# EasyEDA schematic SCH_0516_binaryalarm_2023-05-16.json
TITLE: Sheet_1; REV: 1.0; Date: 2023-05-16; Sheet: 1/1; Drawn By: yubinininin; Company: Your Company
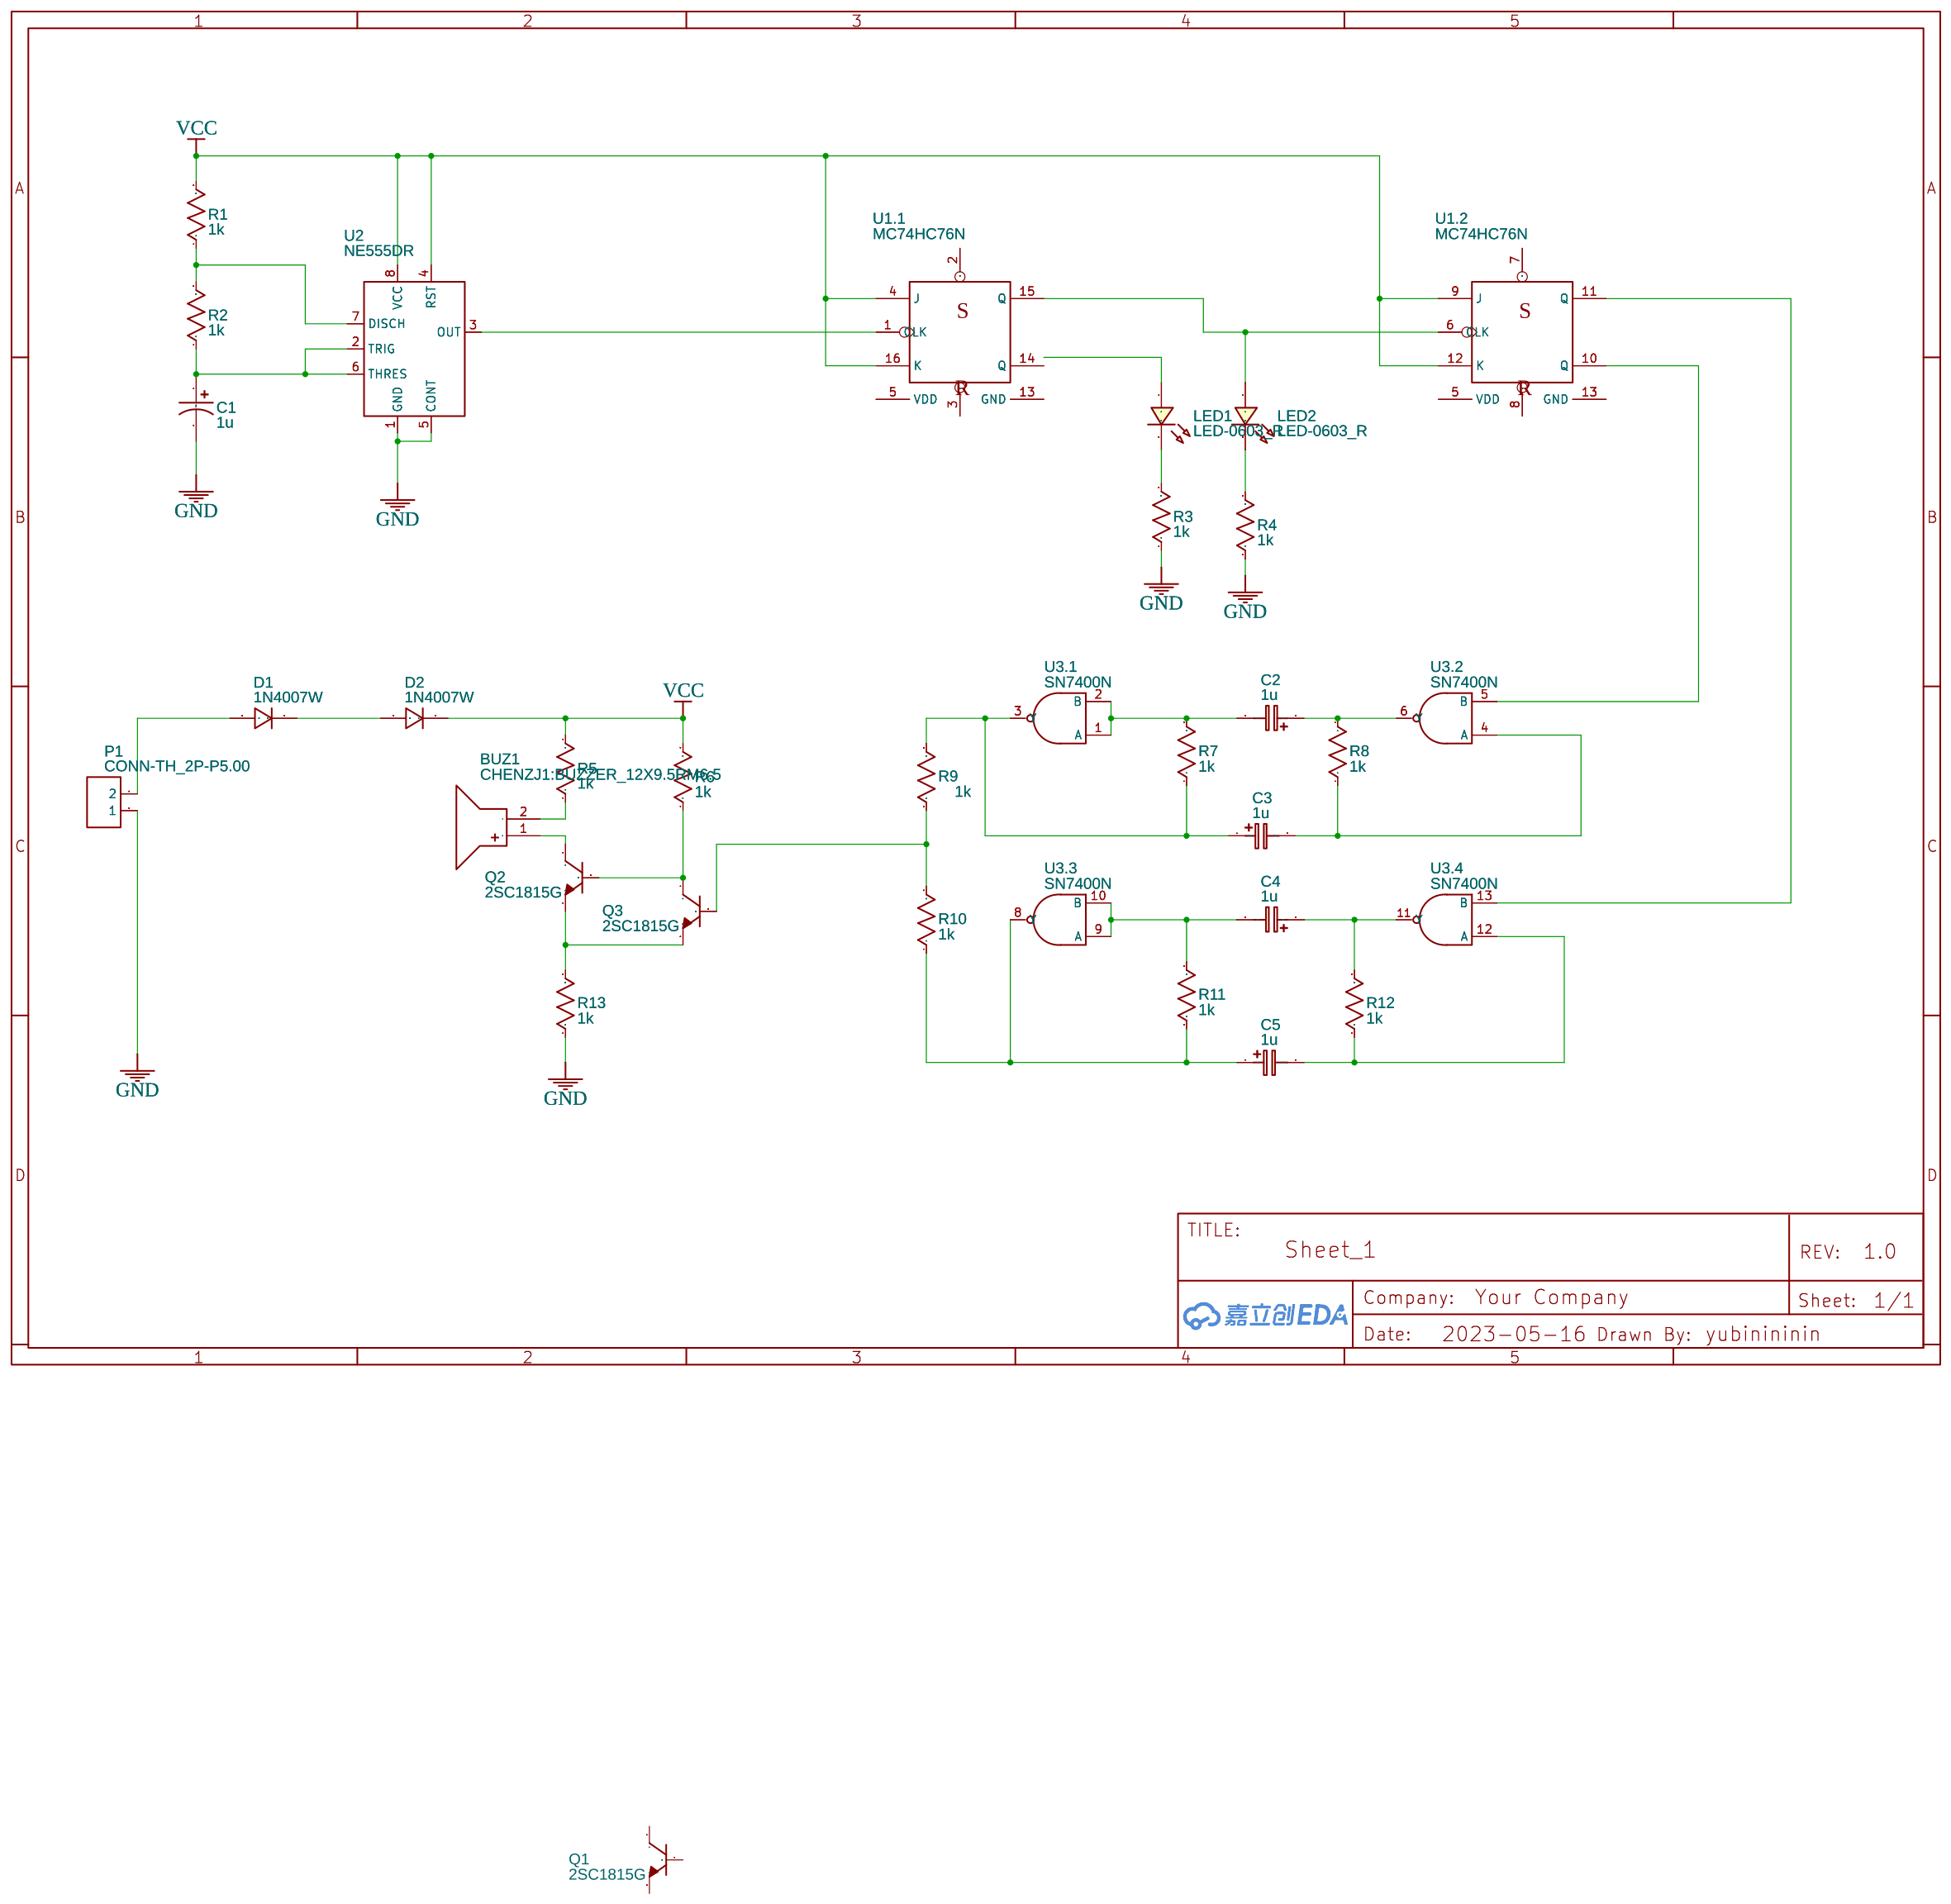
[diagram p0: schematic sheet]

## Parts
BUZ1  CHENZJ1:BUZZER_12X9.5RM6.5  [BUZZ-TH_BD9.8-P5.00-D1.00]
C1  1u  [CAP-D6.3-F2.5]
C2  1u  [CAP-D6.3-F2.5]
C3  1u  [CASE-A_3216]
C4  1u  [CASE-A_3216]
C5  1u  [CASE-A_3216]
D1  1N4007W  [DO-35_BD2.0-L4.2-P8.20-D0.5-RD]
D2  1N4007W  [DO-35_BD2.0-L4.2-P8.20-D0.5-RD]
LED1  LED-0603_R  [LED-TH_BD5.9-P2.54-FD]
LED2  LED-0603_R  [LED-TH_BD5.9-P2.54-FD]
P1  CONN-TH_2P-P5.00  [CONN-TH_2P-P5.00_DB128H-5.0-2P]
Q1  2SC1815G  [TO-92-3_L5.1-W4.1-P1.27-L]
Q2  2SC1815G  [TO-92-3_L5.1-W4.1-P1.27-L]
Q3  2SC1815G  [TO-92-3_L5.1-W4.1-P1.27-L]
R1  1k  [R_AXIAL-0.3]
R2  1k  [R_AXIAL-0.3]
R3  1k  [R_AXIAL-0.3]
R4  1k  [R_AXIAL-0.3]
R5  1k  [R_AXIAL-0.3]
R6  1k  [R_AXIAL-0.3]
R7  1k  [R_AXIAL-0.3]
R8  1k  [R_AXIAL-0.3]
R9  1k  [R_AXIAL-0.3]
R10  1k  [R_AXIAL-0.3]
R11  1k  [R_AXIAL-0.3]
R12  1k  [R_AXIAL-0.3]
R13  1k  [R_AXIAL-0.3]
U1  MC74HC76N  [DIP-16_L20.3-W10.2-P2.54-LS7.6-BL-1]  (sections 1,2)
U2  NE555DR  [DIP-8_L10.2-W10.1-P2.54-LS7.6-BL-1]
U3  SN7400N  [PDIP-14_L19.3-W6.4-P2.54-LS7.9-BL-1]  (sections 1,2,3,4)

## Library data of the parts
BUZ1 = CHENZJ1:BUZZER_12X9.5RM6.5: Supplier: LCSC; Supplier Part: C9900008742; Manufacturer: null; Manufacturer Part: chenzj1:Buzzer_12x9.5RM6.5; JLCPCB Part Class: Extended Part; Contributor: LCSC
C1 = C_Tan_SMD_A_US: Contributor: LCEDA_Lib
C2-C5 = C_Tan_SMD_A_EU: Contributor: LCEDA_Lib
D1 D2 = 1N4007W: Supplier: LCSC; Supplier Part: C328592; Manufacturer: BLUE ROCKET; Contributor: LCEDA_Lib
LED1 LED2 = LED-0603_R: Manufacturer: EVERLIGHT(台湾亿光); Manufacturer Part: 19-217/R6C-AL1M2VY/3T; Supplier Part: C72044; Supplier: LCSC; Contributor: LCEDA_01
P1 = CONN-TH_2P-P5.00: Supplier: LCSC; Contributor: LCEDA_Lib
Q1-Q3 = 2SC1815G: Supplier: LCSC; Manufacturer: ST(先科); Supplier Part: C118545; JLCPCB Part Class: Extended Part; Contributor: yubinininin
R1-R13 = R_0603_US: Contributor: LCEDA_Lib
U1 = MC74HC76N: Dual J-K Flip-Flop with Set and Reset; subpart_no: 1
U2 = NE555DR: Supplier: LCSC; Manufacturer: TI(德州仪器); Supplier Part: C7593; JLCPCB Part Class: Basic Part; Frequency: 100kHz; Contributor: yubinininin
U3 = SN7400N: Supplier: LCSC; Supplier Part: C2860604; Manufacturer: TI(德州仪器); link: https://atta.szlcsc.comnull; subpart_no: 1

## Nets
GND: C1.2 P1.1 R3.1 R4.1 R13.1 U2.1(GND) U2.5(CONT)
VCC: D2.1 R1.2 R5.2 R6.2 U1.4(J) U1.9(J) U1.12(K) U1.16(K) U2.4(RST) U2.8(VCC)
Net-(BUZ1-1): BUZ1.1(+) Q2.1(E)
Net-(BUZ1-2): BUZ1.2(-) R5.1
Net-(C1-1): C1.1 R2.1 U2.2(TRIG) U2.6(THRES)
Net-(C2-1): C2.1 R8.2 U3.6(Y)
Net-(C2-2): C2.2 R7.2 U3.1(A) U3.2(B)
Net-(C3-1): C3.1 R7.1 R9.2 U3.3(Y)
Net-(C3-2): C3.2 R8.1 U3.4(A)
Net-(C4-1): C4.1 R12.2 U3.11(Y)
Net-(C4-2): C4.2 R11.2 U3.9(A) U3.10(B)
Net-(C5-1): C5.1 R10.1 R11.1 U3.8(Y)
Net-(C5-2): C5.2 R12.1 U3.12(A)
Net-(D1-1): D1.1 D2.2
Net-(D1-2): D1.2 P1.2
Net-(LED1-2): LED1.2 R3.2
Net-(LED2-1): LED2.1 U1.6(CLK) U1.15(Q)
Net-(LED2-2): LED2.2 R4.2
Net-(Q2-2): Q2.2(C) Q3.2(C) R13.2
Net-(Q2-3): Q2.3(B) Q3.1(E) R6.1
Net-(Q3-3): Q3.3(B) R9.1 R10.2
Net-(R1-1): R1.1 R2.2 U2.7(DISCH)
Net-(U1.1-1): U1.1(CLK) U2.3(OUT)
Net-(U1.2-10): U1.10(Q) U3.5(B)
Net-(U1.2-11): U1.11(Q) U3.13(B)

Not connected (* = marked no-connect by the designer): LED1 1; Q1 1(E) 2(C) 3(B); U1 2(S) 3(R) 5(VDD) 7(S) 8(R) 13(GND) 14(Q)
